# EAGLE design AeroQuadMiniBare_v100 (EAGLE 5.11)
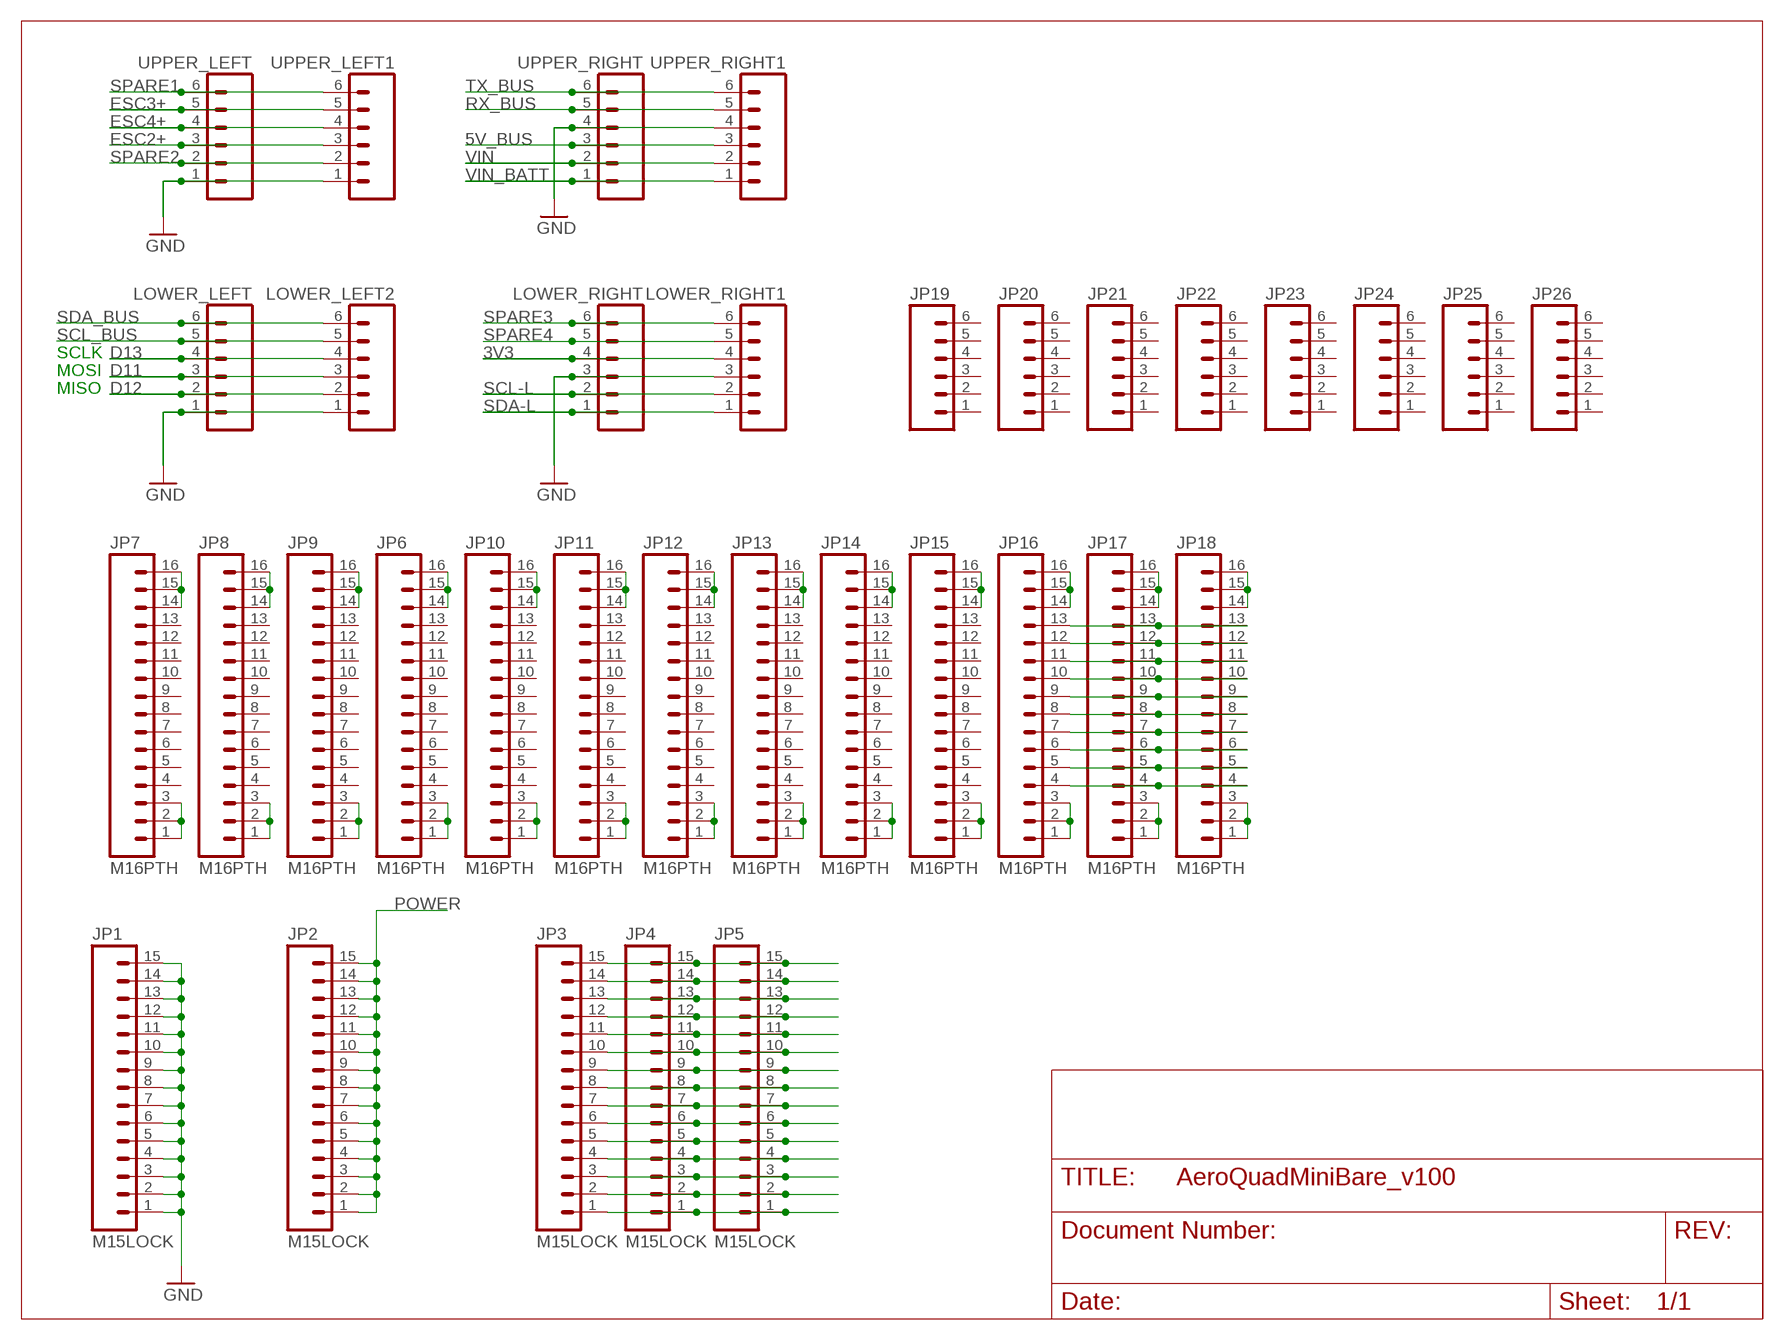
[diagram p0: schematic, sheet 1]

## Parts
JP1  M15LOCK  [1X15_LOCK]
JP2  M15LOCK  [1X15_LOCK]
JP3  M15LOCK  [1X15_LOCK]
JP4  M15LOCK  [1X15_LOCK]
JP5  M15LOCK  [1X15_LOCK]
JP6  M16PTH  [1X16]
JP7  M16PTH  [1X16]
JP8  M16PTH  [1X16]
JP9  M16PTH  [1X16]
JP10  M16PTH  [1X16]
JP11  M16PTH  [1X16]
JP12  M16PTH  [1X16]
JP13  M16PTH  [1X16]
JP14  M16PTH  [1X16]
JP15  M16PTH  [1X16]
JP16  M16PTH  [1X16]
JP17  M16PTH  [1X16]
JP18  M16PTH  [1X16]
JP19  M06SIP  [1X06]
JP20  M06SIP  [1X06]
JP21  M06SIP  [1X06]
JP22  M06SIP  [1X06]
JP23  M06SIP  [1X06]
JP24  M06SIP  [1X06]
JP25  M06SIP  [1X06]
JP26  M06SIP  [1X06]
LOWER_LEFT  M06LOCK  [1X06_LOCK]
LOWER_LEFT2  M06LOCK  [1X06_LOCK]
LOWER_RIGHT  M06LOCK  [1X06_LOCK]
LOWER_RIGHT1  M06LOCK  [1X06_LOCK]
UPPER_LEFT  M06LOCK  [1X06_LOCK]
UPPER_LEFT1  M06LOCK  [1X06_LOCK]
UPPER_RIGHT  M06LOCK  [1X06_LOCK]
UPPER_RIGHT1  M06LOCK  [1X06_LOCK]

## Nets
3V3: LOWER_RIGHT1.4 LOWER_RIGHT.4
5V_BUS: UPPER_RIGHT1.3 UPPER_RIGHT.3
D11: LOWER_LEFT2.3 LOWER_LEFT.3
D12: LOWER_LEFT2.2 LOWER_LEFT.2
D13: LOWER_LEFT2.4 LOWER_LEFT.4
ESC2+: UPPER_LEFT1.3 UPPER_LEFT.3
ESC3+: UPPER_LEFT1.5 UPPER_LEFT.5
ESC4+: UPPER_LEFT1.4 UPPER_LEFT.4
GND: JP1.1 JP1.2 JP1.3 JP1.4 JP1.5 JP1.6 JP1.7 JP1.8 JP1.9 JP1.10 JP1.11 JP1.12 JP1.13 JP1.14 JP1.15 LOWER_LEFT2.1 LOWER_LEFT.1 LOWER_RIGHT1.3 LOWER_RIGHT.3 UPPER_LEFT1.1 UPPER_LEFT.1 UPPER_RIGHT1.4 UPPER_RIGHT.4
N$1: JP3.15 JP4.15 JP5.15
N$2: JP3.14 JP4.14 JP5.14
N$3: JP3.13 JP4.13 JP5.13
N$4: JP3.12 JP4.12 JP5.12
N$5: JP3.11 JP4.11 JP5.11
N$6: JP3.10 JP4.10 JP5.10
N$7: JP3.9 JP4.9 JP5.9
N$8: JP3.8 JP4.8 JP5.8
N$9: JP3.7 JP4.7 JP5.7
N$10: JP3.6 JP4.6 JP5.6
N$11: JP3.5 JP4.5 JP5.5
N$12: JP3.4 JP4.4 JP5.4
N$13: JP3.3 JP4.3 JP5.3
N$14: JP3.2 JP4.2 JP5.2
N$15: JP3.1 JP4.1 JP5.1
N$17: JP7.14 JP7.15 JP7.16
N$18: JP8.14 JP8.15 JP8.16
N$19: JP8.1 JP8.2 JP8.3
N$20: JP7.1 JP7.2 JP7.3
N$21: JP9.1 JP9.2 JP9.3
N$22: JP6.1 JP6.2 JP6.3
N$23: JP10.1 JP10.2 JP10.3
N$24: JP11.1 JP11.2 JP11.3
N$25: JP12.1 JP12.2 JP12.3
N$26: JP13.1 JP13.2 JP13.3
N$27: JP14.1 JP14.2 JP14.3
N$28: JP15.1 JP15.2 JP15.3
N$29: JP16.1 JP16.2 JP16.3
N$30: JP17.1 JP17.2 JP17.3
N$31: JP18.1 JP18.2 JP18.3
N$32: JP18.14 JP18.15 JP18.16
N$33: JP17.14 JP17.15 JP17.16
N$34: JP16.14 JP16.15 JP16.16
N$35: JP15.14 JP15.15 JP15.16
N$36: JP14.14 JP14.15 JP14.16
N$37: JP13.14 JP13.15 JP13.16
N$38: JP12.14 JP12.15 JP12.16
N$39: JP11.14 JP11.15 JP11.16
N$40: JP10.14 JP10.15 JP10.16
N$41: JP6.14 JP6.15 JP6.16
N$42: JP9.14 JP9.15 JP9.16
N$43: JP16.13 JP17.13 JP18.13
N$44: JP16.12 JP17.12 JP18.12
N$45: JP16.11 JP17.11 JP18.11
N$46: JP16.10 JP17.10 JP18.10
N$47: JP16.9 JP17.9 JP18.9
N$48: JP16.8 JP17.8 JP18.8
N$49: JP16.7 JP17.7 JP18.7
N$50: JP16.6 JP17.6 JP18.6
N$51: JP16.5 JP17.5 JP18.5
N$52: JP16.4 JP17.4 JP18.4
POWER: JP2.1 JP2.2 JP2.3 JP2.4 JP2.5 JP2.6 JP2.7 JP2.8 JP2.9 JP2.10 JP2.11 JP2.12 JP2.13 JP2.14 JP2.15
RX_BUS: UPPER_RIGHT1.5 UPPER_RIGHT.5
SCL-L: LOWER_RIGHT1.2 LOWER_RIGHT.2
SCL_BUS: LOWER_LEFT2.5 LOWER_LEFT.5
SDA-L: LOWER_RIGHT1.1 LOWER_RIGHT.1
SDA_BUS: LOWER_LEFT2.6 LOWER_LEFT.6
SPARE1: UPPER_LEFT1.6 UPPER_LEFT.6
SPARE2: UPPER_LEFT1.2 UPPER_LEFT.2
SPARE3: LOWER_RIGHT1.6 LOWER_RIGHT.6
SPARE4: LOWER_RIGHT1.5 LOWER_RIGHT.5
TX_BUS: UPPER_RIGHT1.6 UPPER_RIGHT.6
VIN: UPPER_RIGHT1.2 UPPER_RIGHT.2
VIN_BATT: UPPER_RIGHT1.1 UPPER_RIGHT.1
Unconnected: JP6.4 JP6.5 JP6.6 JP6.7 JP6.8 JP6.9 JP6.10 JP6.11 JP6.12 JP6.13 JP7.4 JP7.5 JP7.6 JP7.7 JP7.8 JP7.9 JP7.10 JP7.11 JP7.12 JP7.13 JP8.4 JP8.5 JP8.6 JP8.7 JP8.8 JP8.9 JP8.10 JP8.11 JP8.12 JP8.13 JP9.4 JP9.5 JP9.6 JP9.7 JP9.8 JP9.9 JP9.10 JP9.11 JP9.12 JP9.13 JP10.4 JP10.5 JP10.6 JP10.7 JP10.8 JP10.9 JP10.10 JP10.11 JP10.12 JP10.13 JP11.4 JP11.5 JP11.6 JP11.7 JP11.8 JP11.9 JP11.10 JP11.11 JP11.12 JP11.13 JP12.4 JP12.5 JP12.6 JP12.7 JP12.8 JP12.9 JP12.10 JP12.11 JP12.12 JP12.13 JP13.4 JP13.5 JP13.6 JP13.7 JP13.8 JP13.9 JP13.10 JP13.11 JP13.12 JP13.13 JP14.4 JP14.5 JP14.6 JP14.7 JP14.8 JP14.9 JP14.10 JP14.11 JP14.12 JP14.13 JP15.4 JP15.5 JP15.6 JP15.7 JP15.8 JP15.9 JP15.10 JP15.11 JP15.12 JP15.13 JP19.1 JP19.2 JP19.3 JP19.4 JP19.5 JP19.6 JP20.1 JP20.2 JP20.3 JP20.4 JP20.5 JP20.6 JP21.1 JP21.2 JP21.3 JP21.4 JP21.5 JP21.6 JP22.1 JP22.2 JP22.3 JP22.4 JP22.5 JP22.6 JP23.1 JP23.2 JP23.3 JP23.4 JP23.5 JP23.6 JP24.1 JP24.2 JP24.3 JP24.4 JP24.5 JP24.6 JP25.1 JP25.2 JP25.3 JP25.4 JP25.5 JP25.6 JP26.1 JP26.2 JP26.3 JP26.4 JP26.5 JP26.6

## Notes on the sheet
- SCLK
- MOSI
- MISO

## Library data of the parts
JP1-JP5 = SparkFun:M15: Header 15 Standard 15-pin 0.1" header. Use with straight break away headers (SKU : PRT-00116), right angle break away headers (PRT-00553), swiss pins (PRT-00743), machine pins (PRT-00117), and female headers (PRT-00115).
JP6-JP18 = SparkFun:M16
JP19-JP26 LOWER_LEFT LOWER_LEFT2 LOWER_RIGHT LOWER_RIGHT1 UPPER_LEFT UPPER_LEFT1 UPPER_RIGHT UPPER_RIGHT1 = SparkFun:M06: Header 6 Standard 6-pin 0.1" header. Use with straight break away headers (SKU : PRT-00116), right angle break away headers (PRT-00553), swiss pins (PRT-00743), machine pins (PRT-00117), and female headers (PRT-00115). Molex polarized connector foot print use with SKU : PRT-08094 with associated crimp pins and housings. NOTES ON THE VARIANTS LOCK and LOCK_LONGPADS... This footprint was designed to help hold the alignment of a through-hole component (i.e. 6-pin header) while soldering it into place. You may notice that each hole has been shifted either up or down by 0.005 of an inch from it's more standard position (which is a perfectly straight line). This slight alteration caused the pins (the squares in the middle) to touch the edges of the holes. Because they are alternating, it causes a "brace" to hold the component in place. 0.005 has proven to be the perfect amount of "off-center" position when using our standard breakaway headers. Although looks a little odd when you look at the bare footprint, once you have a header in there, the alteration is very hard to notice. Also, if you push a header all the way into place, it is covered up entirely on the bottom side. This idea of altering the position of holes to aid alignment will be further integrated into the Sparkfun Library for other footprints. It can help hold any component with 3 or more connection pins.

## Net classes
1 power: width 0.381 mm, clearance 0.254 mm

## Board
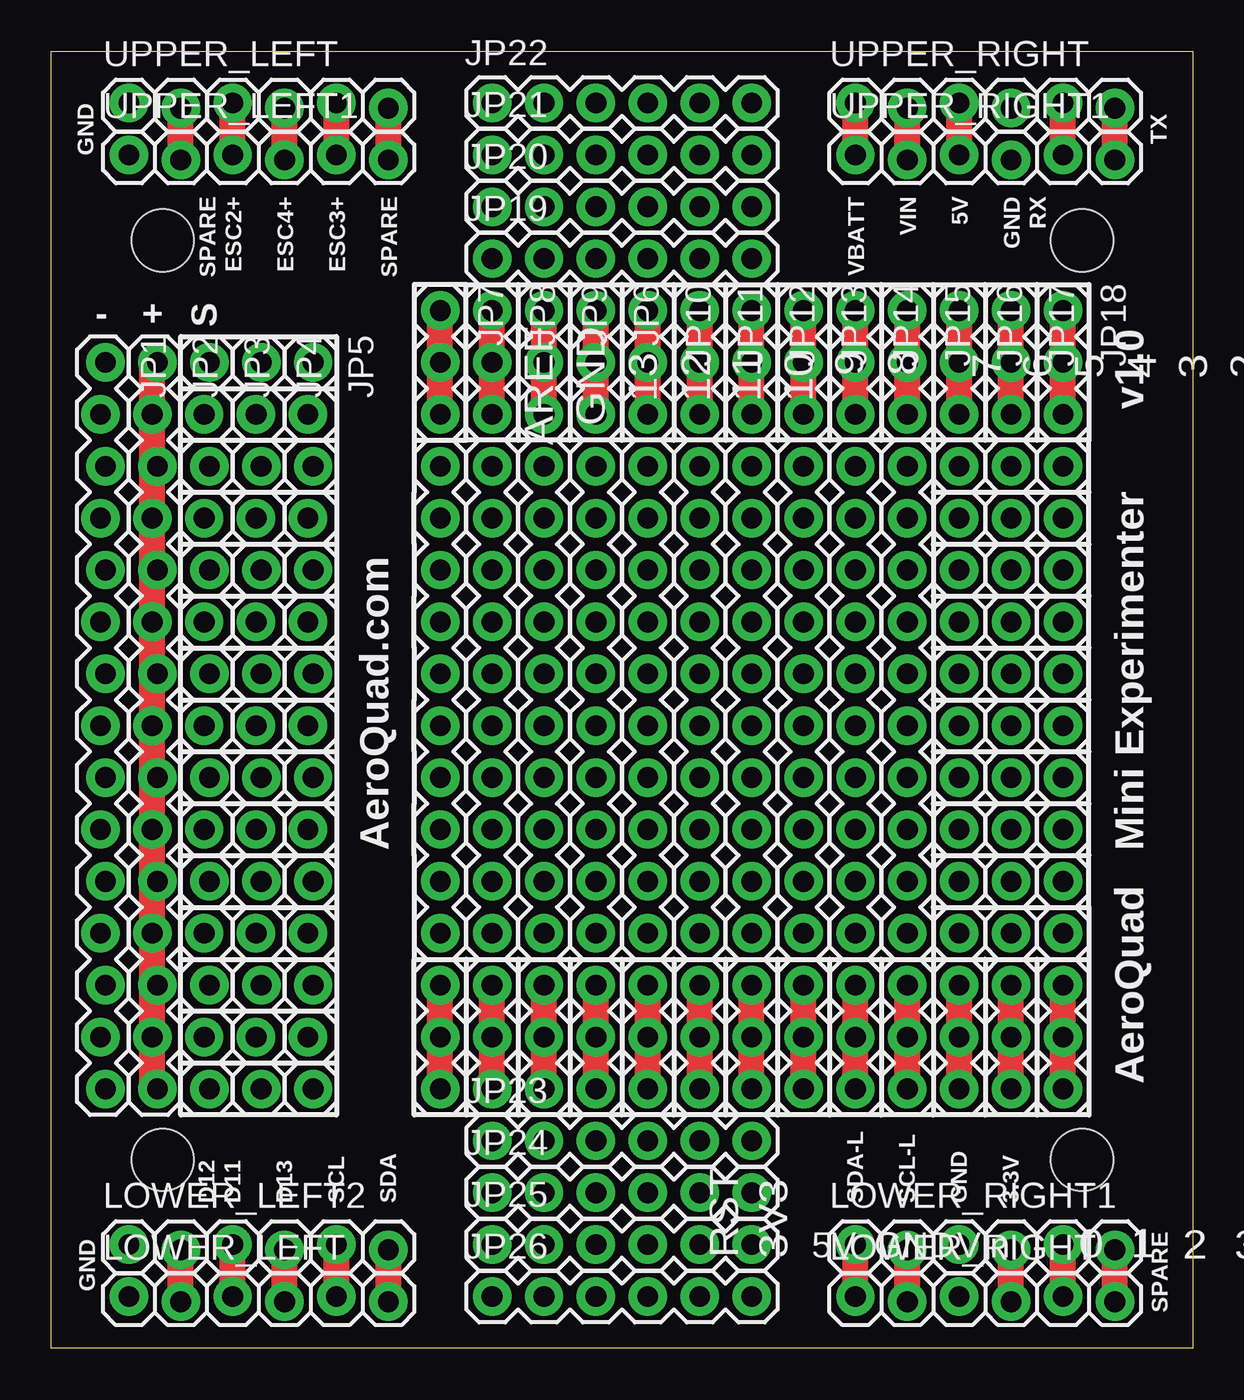
[diagram p1: board, top side]
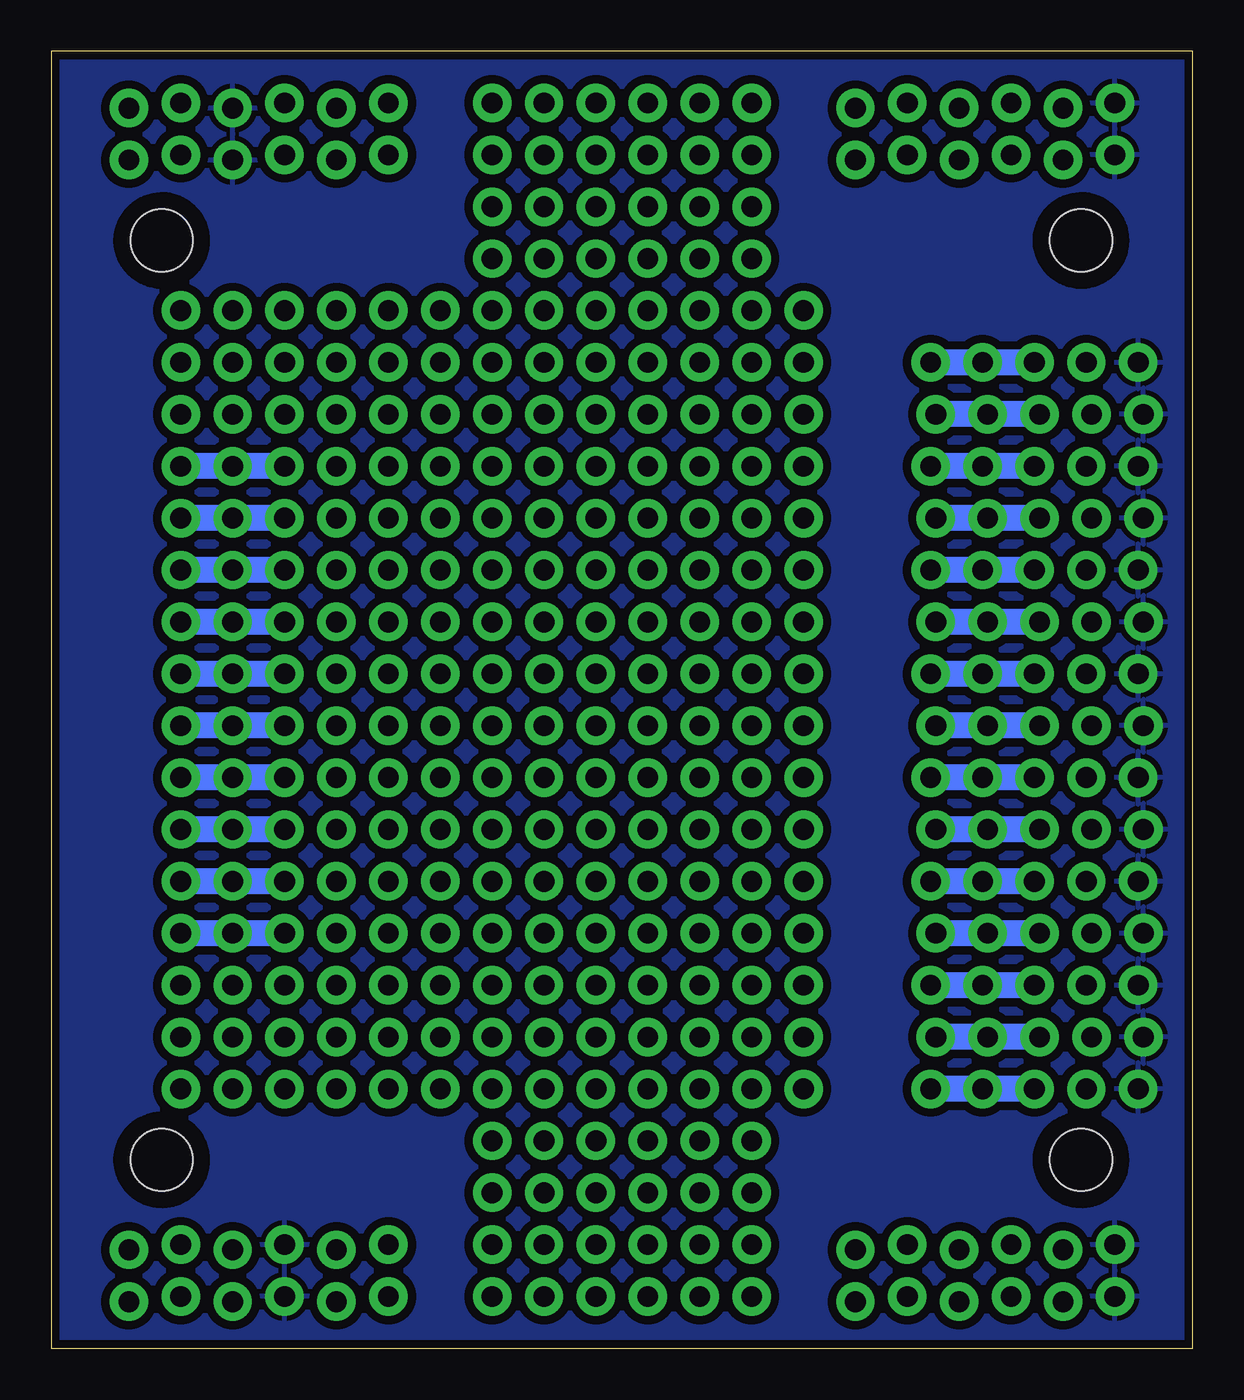
[diagram p2: board, bottom side, seen from below]

Size 55.88 x 63.5 mm. Coordinates in mm from the lower left corner, seen from the top.
Outline: 0,63.5 55.88,63.5 55.88,0 0,0 0,63.5
Copper layers (1*16): Top 0.035mm / dielectric 1.5mm / Bottom 0.035mm
Design rules "SparkFun": minimum track width 8mil, minimum drill 20mil, track to track 8mil, track to pad 8mil, pad to pad 8mil, via to via 8mil, smd to smd 8mil, copper to edge 10mil, drill to drill 8mil, minimum pad ring 12mil, minimum via ring 10mil, stop-mask expansion 4mil, vias tented up to drill 25mil, thermal gap 10mil

### Footprints (pad centres in the part's own frame; a part is rotated, then mirrored left to right if it is on the bottom)
1X15_LOCK = drill 1.016 pad 1.88 round: 1 0,0.127; 2 2.54,-0.127; 3 5.08,0.127; 4 7.62,-0.127; 5 10.16,0.127; 6 12.7,-0.127; 7 15.24,0.127; 8 17.78,-0.127; 9 20.32,0.127; 10 22.86,-0.127; 11 25.4,0.127; 12 27.94,-0.127; 13 30.48,0.127; 14 33.02,-0.127; 15 35.56,0.127
1X16 = drill 1.016 pad 1.88 round: 1 0,0; 2 2.54,0; 3 5.08,0; 4 7.62,0; 5 10.16,0; 6 12.7,0; 7 15.24,0; 8 17.78,0; 9 20.32,0; 10 22.86,0; 11 25.4,0; 12 27.94,0; 13 30.48,0; 14 33.02,0; 15 35.56,0; 16 38.1,0
1X06 = drill 1.016 pad 1.88 round: 1 0,0; 2 2.54,0; 3 5.08,0; 4 7.62,0; 5 10.16,0; 6 12.7,0
1X06_LOCK = drill 1.016 pad 1.88 round: 1 0,0; 2 2.54,-0.254; 3 5.08,0; 4 7.62,-0.254; 5 10.16,0; 6 12.7,-0.254
STAND-OFF-TIGHT = hole 3.048: 0,0

### Placement (x,y rotation side)
JP1  2.54,48.26 270 top
JP2  5.08,48.26 270 top
JP3  7.62,48.26 270 top
JP4  10.16,48.26 270 top
JP5  12.7,48.26 270 top
JP6  26.67,50.8 270 top
JP7  19.05,50.8 270 top
JP8  21.59,50.8 270 top
JP9  24.13,50.8 270 top
JP10  29.21,50.8 270 top
JP11  31.75,50.8 270 top
JP12  34.29,50.8 270 top
JP13  36.83,50.8 270 top
JP14  39.37,50.8 270 top
JP15  41.91,50.8 270 top
JP16  44.45,50.8 270 top
JP17  46.99,50.8 270 top
JP18  49.53,50.8 270 top
JP19  21.59,53.34 0 top
JP20  21.59,55.88 0 top
JP21  21.59,58.42 0 top
JP22  21.59,60.96 0 top
JP23  21.59,10.16 0 top
JP24  21.59,7.62 0 top
JP25  21.59,5.08 0 top
JP26  21.59,2.54 0 top
LOWER_LEFT  3.81,2.54 0 top
LOWER_LEFT2  3.81,5.08 0 top
LOWER_RIGHT  39.37,2.54 0 top
LOWER_RIGHT1  39.37,5.08 0 top
U$1  [STAND-OFF-TIGHT]  5.46,9.23 0 top
U$2  [STAND-OFF-TIGHT]  50.46,9.23 0 top
U$3  [STAND-OFF-TIGHT]  50.46,54.23 0 top
U$5  [STAND-OFF-TIGHT]  5.46,54.23 0 top
UPPER_LEFT  3.81,60.96 0 top
UPPER_LEFT1  3.81,58.42 0 top
UPPER_RIGHT  39.37,60.96 0 top
UPPER_RIGHT1  39.37,58.42 0 top

### Tracks (layer width: path | path; a pad name or v marks a point on that pad's centre or on a via)
3V3
  Top 1.27: LOWER_RIGHT.4 LOWER_RIGHT1.4
5V_BUS
  Top 1.27: UPPER_RIGHT1.3 UPPER_RIGHT.3
D11
  Top 1.27: LOWER_LEFT.3 LOWER_LEFT2.3
D12
  Top 1.27: LOWER_LEFT.2 LOWER_LEFT2.2
D13
  Top 1.27: LOWER_LEFT.4 LOWER_LEFT2.4
ESC2+
  Top 1.27: UPPER_LEFT1.3 UPPER_LEFT.3
ESC3+
  Top 1.27: UPPER_LEFT1.5 UPPER_LEFT.5
ESC4+
  Top 1.27: UPPER_LEFT1.4 UPPER_LEFT.4
GND
  pour Bottom (isolate 0.406): 0,63.5 55.88,63.5 55.88,0 0,0
N$1
  Bottom 1.27: JP3.15 JP4.15 JP5.15
N$2
  Bottom 1.27: JP3.14 JP4.14 JP5.14
N$3
  Bottom 1.27: JP3.13 JP4.13 JP5.13
N$4
  Bottom 1.27: JP3.12 JP4.12 JP5.12
N$5
  Bottom 1.27: JP3.11 JP4.11 JP5.11
N$6
  Bottom 1.27: JP3.10 JP4.10 JP5.10
N$7
  Bottom 1.27: JP3.9 JP4.9 JP5.9
N$8
  Bottom 1.27: JP3.8 JP4.8 JP5.8
N$9
  Bottom 1.27: JP3.7 JP4.7 JP5.7
N$10
  Bottom 1.27: JP3.6 JP4.6 JP5.6
N$11
  Bottom 1.27: JP3.5 JP4.5 JP5.5
N$12
  Bottom 1.27: JP3.4 JP4.4 JP5.4
N$13
  Bottom 1.27: JP3.3 JP4.3 JP5.3
N$14
  Bottom 1.27: JP3.2 JP4.2 JP5.2
N$15
  Bottom 1.27: JP3.1 JP4.1 JP5.1
N$17
  Top 1.27: JP7.14 JP7.15 JP7.16
N$18
  Top 1.27: JP8.14 JP8.15 JP8.16
N$19
  Top 1.27: JP8.1 JP8.2 JP8.3
N$20
  Top 1.27: JP7.1 JP7.2 JP7.3
N$21
  Top 1.27: JP9.1 JP9.2 JP9.3
N$22
  Top 1.27: JP6.1 JP6.2 JP6.3
N$23
  Top 1.27: JP10.1 JP10.2 JP10.3
N$24
  Top 1.27: JP11.1 JP11.2 JP11.3
N$25
  Top 1.27: JP12.1 JP12.2 JP12.3
N$26
  Top 1.27: JP13.1 JP13.2 JP13.3
N$27
  Top 1.27: JP14.1 JP14.2 JP14.3
N$28
  Top 1.27: JP15.1 JP15.2 JP15.3
N$29
  Top 1.27: JP16.1 JP16.2 JP16.3
N$30
  Top 1.27: JP17.1 JP17.2 JP17.3
N$31
  Top 1.27: JP18.1 JP18.2 JP18.3
N$32
  Top 1.27: JP18.14 JP18.15 JP18.16
N$33
  Top 1.27: JP17.14 JP17.15 JP17.16
N$34
  Top 1.27: JP16.14 JP16.15 JP16.16
N$35
  Top 1.27: JP15.14 JP15.15 JP15.16
N$36
  Top 1.27: JP14.14 JP14.15 JP14.16
N$37
  Top 1.27: JP13.14 JP13.15 JP13.16
N$38
  Top 1.27: JP12.14 JP12.15 JP12.16
N$39
  Top 1.27: JP11.14 JP11.15 JP11.16
N$40
  Top 1.27: JP10.14 JP10.15 JP10.16
N$41
  Top 1.27: JP6.14 JP6.15 JP6.16
N$42
  Top 1.27: JP9.14 JP9.15 JP9.16
N$43
  Bottom 1.27: JP16.13 JP17.13 JP18.13
N$44
  Bottom 1.27: JP16.12 JP17.12 JP18.12
N$45
  Bottom 1.27: JP16.11 JP17.11 JP18.11
N$46
  Bottom 1.27: JP16.10 JP17.10 JP18.10
N$47
  Bottom 1.27: JP16.9 JP17.9 JP18.9
N$48
  Bottom 1.27: JP16.8 JP17.8 JP18.8
N$49
  Bottom 1.27: JP16.7 JP17.7 JP18.7
N$50
  Bottom 1.27: JP16.6 JP17.6 JP18.6
N$51
  Bottom 1.27: JP16.5 JP17.5 JP18.5
N$52
  Bottom 1.27: JP16.4 JP17.4 JP18.4
POWER
  Top 1.27: JP2.1 4.95,48.01 JP2.2 4.95,43.43 JP2.3 4.95,42.93 JP2.4 4.95,38.35 JP2.5 4.95,37.85 JP2.6 4.95,33.27 JP2.7 4.95,32.77 JP2.8 4.95,28.19 JP2.9 4.95,27.69 JP2.10 4.95,23.11 JP2.11 4.95,22.61 JP2.12 4.95,18.03 JP2.13 4.95,17.53 JP2.14 4.95,12.95 JP2.15
RX_BUS
  Top 1.27: UPPER_RIGHT1.5 UPPER_RIGHT.5
SCL-L
  Top 1.27: LOWER_RIGHT.2 LOWER_RIGHT1.2
SCL_BUS
  Top 1.27: LOWER_LEFT.5 LOWER_LEFT2.5
SDA-L
  Top 1.27: LOWER_RIGHT.1 LOWER_RIGHT1.1
SDA_BUS
  Top 1.27: LOWER_LEFT.6 LOWER_LEFT2.6
SPARE1
  Top 1.27: UPPER_LEFT1.6 UPPER_LEFT.6
SPARE2
  Top 1.27: UPPER_LEFT1.2 UPPER_LEFT.2
SPARE3
  Top 1.27: LOWER_RIGHT.6 LOWER_RIGHT1.6
SPARE4
  Top 1.27: LOWER_RIGHT.5 LOWER_RIGHT1.5
TX_BUS
  Top 1.27: UPPER_RIGHT1.6 UPPER_RIGHT.6
VIN
  Top 1.27: UPPER_RIGHT1.2 UPPER_RIGHT.2
VIN_BATT
  Top 1.27: UPPER_RIGHT1.1 UPPER_RIGHT.1

### Text on the board
tPlace: GND | TX | SPARE | ESC2+ | ESC4+ | ESC3+ | SPARE | VBATT | VIN | 5V | GND | RX | + | S | - | v1.0 | AeroQuad.com | Mini Experimenter | AeroQuad | D12 | D11 | D13 | SCL | SDA | SDA-L | SCL-L | GND | 3.3V | SPARE | GND
tNames: 9 | 8 | 7 | 6 | 5 | 4 | 3 | 2 | 1 | 0 | 13 | 12 | 11 | 10 | GND | AREF | RST | 3V3 | 5V | GND | Vin | 0 | 1 | 2 | 3 | 4 | 5